# Altium schematic sheet DC-Cable.SchDoc: DC-Cable
size A4; Date: JUN 2020; ApprovedBy: Hören; CheckedBy: Mörz; Author: Rudziński; CompanyName: Semi-ATE; DrawnBy: Rudziński; Engineer: Hören; Organization: Semi-ATE; DocumentNumber: 13; Revision: V1.0; SheetNumber: 13; SheetTotal: 20
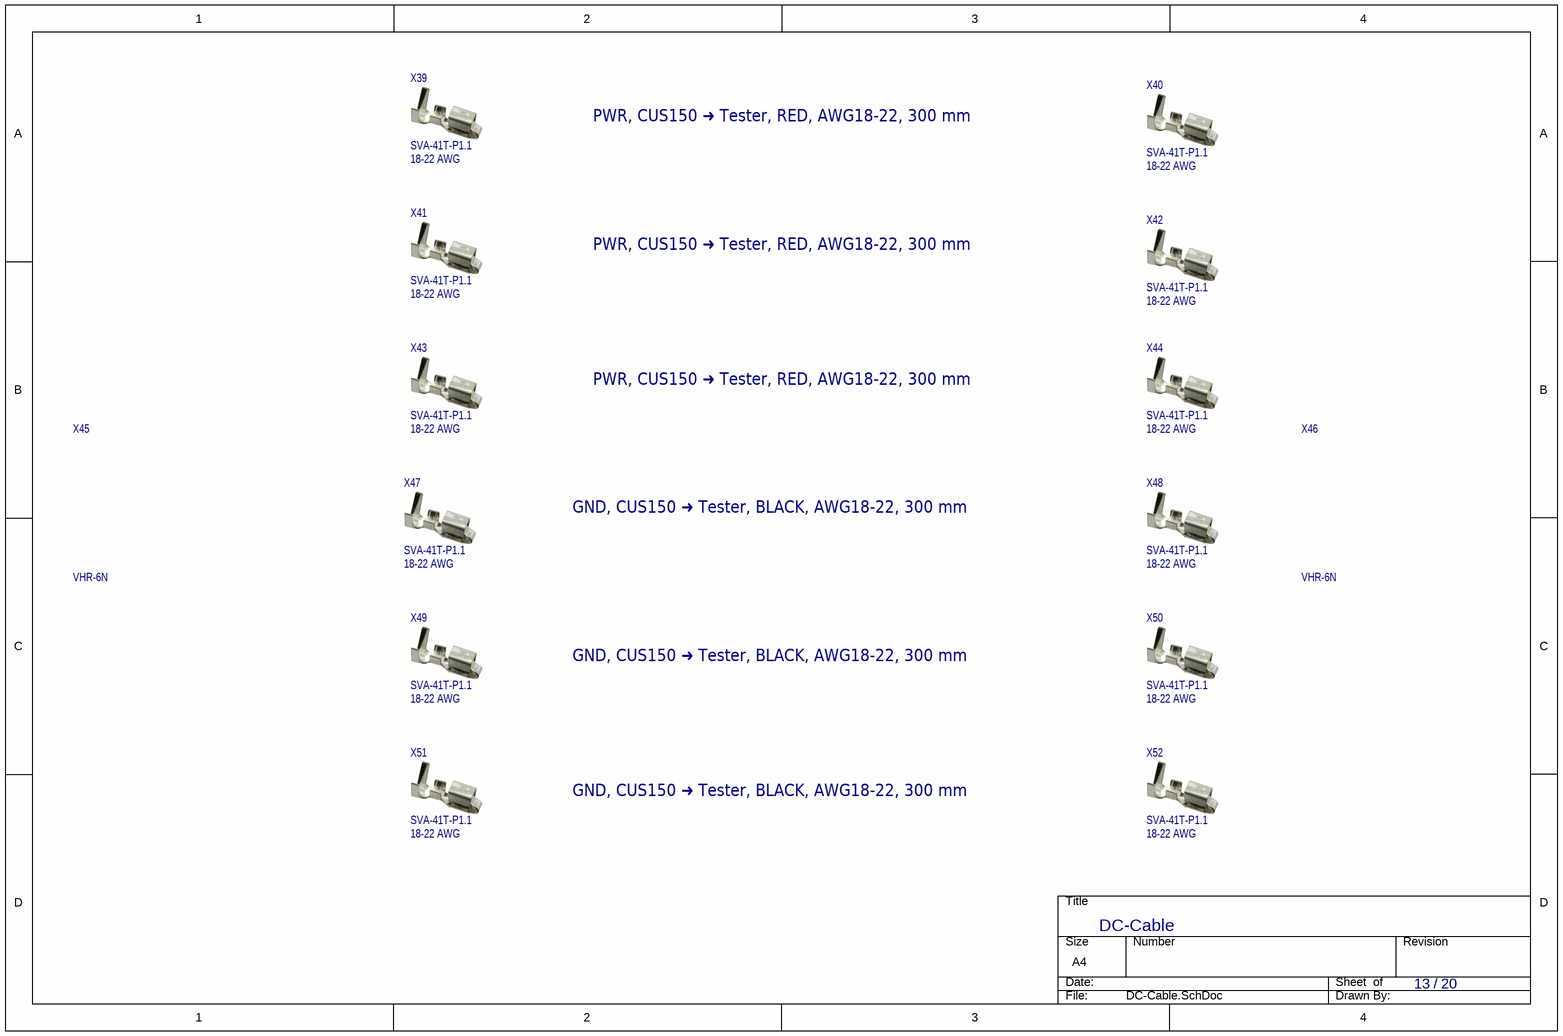
[diagram p0: DC-Cable.SchDoc]

## Parts
X39  Package: 18-22 AWG  (hidden comment: X)
X40  Package: 18-22 AWG  (hidden comment: X)
X41  Package: 18-22 AWG  (hidden comment: X)
X42  Package: 18-22 AWG  (hidden comment: X)
X43  Package: 18-22 AWG  (hidden comment: X)
X44  Package: 18-22 AWG  (hidden comment: X)
X45  VHR-6N
X46  VHR-6N
X47  Package: 18-22 AWG  (hidden comment: X)
X48  Package: 18-22 AWG  (hidden comment: X)
X49  Package: 18-22 AWG  (hidden comment: X)
X50  Package: 18-22 AWG  (hidden comment: X)
X51  Package: 18-22 AWG  (hidden comment: X)
X52  Package: 18-22 AWG  (hidden comment: X)

## Notes on the sheet
- PWR, CUS150 ➜ Tester, RED, AWG18-22, 300 mm
- GND, CUS150 ➜ Tester, BLACK, AWG18-22, 300 mm
- /
- designed by
- reviewed by
- last drawn by
- Project:
- Schematic:
- last printed
- DIN-A4 L
- sheets
- of
- File:

## Library data of the parts
X39-X44 X47-X52 = SVA-41T-P1.1: CONN SOCKET 18-20AWG CRIMP TIN; 04. Manufacturer: JST Sales America Inc.; 03. Unit Price: 0.1; 13. Created Date/Name: AUG 2018 / Hören; 01. Distributor: DigiKey; 02. Distributor Part Number: 455-2964-1-ND; 11. RoHS: YES; ComponentLink1Description: Info; ComponentLink1URL: https://www.digikey.de/product-detail/en/jst-sales-america-inc/SVH-21T-P1-1/455-1133-1-ND/527367; ComponentLink2Description: DataSheet; ComponentLink2URL: http://www.jst-mfg.com/product/pdf/eng/eVH.pdf; 07. Manufacturer  Part Number: SVA-41T-P1.1
X45 X46 = VHR-6N: 6 Rectangular Connectors - Housings Receptacle Natural 0.156" (3.96mm); 04. Manufacturer: JST Sales America Inc.; 03. Unit Price: 0.18; 13. Created Date/Name: AUG 2018 / Hören; 01. Distributor: DigiKey; 02. Distributor Part Number: 455-1187-ND; 11. RoHS: YES; ComponentLink1Description: Info; ComponentLink1URL: https://www.digikey.de/products/en?keywords=VHR-6N; ComponentLink2Description: DataSheet; ComponentLink2URL: http://www.jst-mfg.com/product/pdf/eng/eVH.pdf; 07. Manufacturer  Part Number: VHR-6N